# Altium schematic sheet Sheet1.SchDoc: Project Vega - Client Node
size A4; DrawnBy: Jithendra H S; Revision: 1; SheetNumber: 2; SheetTotal: 2
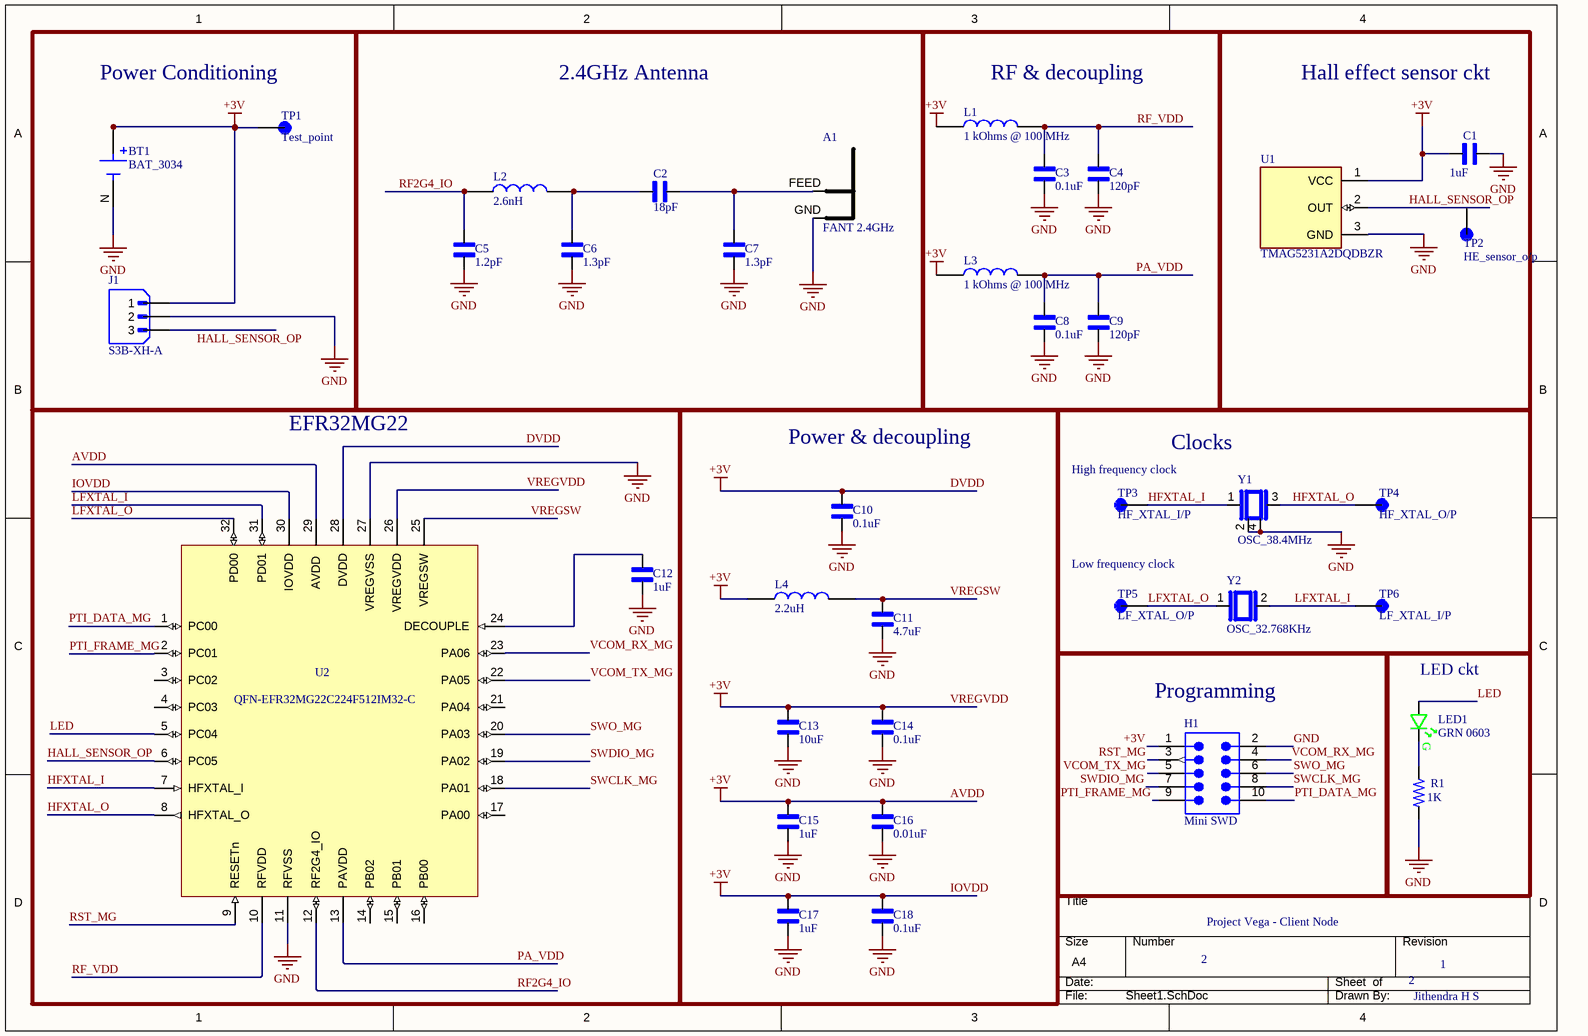
[diagram p0: Sheet1.SchDoc]

## Parts
A1  FANT 2.4GHz  [FANT_2P4]
BT1  BAT_3034  [BAT_3034]
C1  1uF  [CAPC1608X90]
C2  18pF  [CAPC1608X90]
C3  0.1uF  [CAPC1608X90]
C4  120pF  [CAPC1608X90]
C5  1.2pF  [CAPC1608X90]
C6  1.3pF  [CAPC1608X90]
C7  1.3pF  [CAPC1608X90]
C8  0.1uF  [CAPC1608X90]
C9  120pF  [CAPC1608X90]
C10  0.1uF  [CAPC1608X90]
C11  4.7uF  [CAPC1608X90]
C12  1uF  [CAPC1608X90]
C13  10uF  [CAPC1608X90]
C14  0.1uF  [CAPC1608X90]
C15  1uF  [CAPC1608X90]
C16  0.01uF  [CAPC1608X90]
C17  1uF  [CAPC1608X90]
C18  0.1uF  [CAPC1608X90]
H1  Mini SWD  [FTSH-105-01-XXX-DV-K]
J1  S3B-XH-A  [JST_S3B-XH-A]
L1  1 kOhms @ 100 MHz  [INDC1608X95N]
L2  2.6nH  [INDC1608X95N]
L3  1 kOhms @ 100 MHz  [INDC1608X95N]
L4  2.2uH  [INDC1608X95N]
LED1  GRN 0603  [LED_0603_GRN_WL-SMCW]
R1  1K  [RES_0603]
TP1  Test_point  [TP]
TP2  HE_sensor_o/p  [TP]
TP3  HF_XTAL_I/P  [TP]
TP4  HF_XTAL_O/P  [TP]
TP5  LF_XTAL_O/P  [TP]
TP6  LF_XTAL_I/P  [TP]
U1  TMAG5231A2DQDBZR  [SOT95P237X112-3N]
U2  QFN-EFR32MG22C224F512IM32-C  [QFN32-EFR32xG2xIM32-BR]
Y1  OSC_38.4MHz  [OSC_38.4MHz]
Y2  OSC_32.768KHz  [OSC_32.768KHz]

## Blocks framed on the sheet
Power Conditioning: BT1 J1 TP1
2.4GHz Antenna: A1 C2 C5-C7 L2
RF & decoupling: C3 C4 C8 C9 L1 L3
Hall effect sensor ckt: C1 TP2 U1
EFR32MG22: C12 U2
Power & decoupling: C10 C11 C13-C18 L4
Clocks: TP3-TP6 Y1 Y2
Programming: H1
LED ckt: LED1 R1

## Nets
+3V: BT1.P1(POS) BT1.P2(POS) C1.2 C10.1 C13.1 C14.1 C15.1 C16.1 C17.1 C18.1 H1.1 J1.1 L1.1 L3.1 L4.1 TP1.TP U1.1(VCC) U2.26(VREGVDD) U2.28(DVDD) U2.29(AVDD) U2.30(IOVDD)  [also labelled AVDD, DVDD, IOVDD, VREGVDD]
GND: A1.GND BT1.N(NEG) C1.1 C3.2 C4.2 C5.2 C6.2 C7.2 C8.2 C9.2 C10.2 C11.2 C12.2 C13.2 C14.2 C15.2 C16.2 C17.2 C18.2 H1.2 J1.2 R1.2 U1.3(GND) U2.11(RFVSS) U2.27(VREGVSS) Y1.2 Y1.4
HALL_SENSOR_OP: J1.3 TP2.TP U1.2(OUT) U2.6(PC05)
HFXTAL_I: TP3.TP U2.7(HFXTAL_I) Y1.1
HFXTAL_O: TP4.TP U2.8(HFXTAL_O) Y1.3
LED: LED1.A U2.5(PC04)
LFXTAL_I: TP6.TP U2.31(PD01) Y2.2
LFXTAL_O: TP5.TP U2.32(PD00) Y2.1
PA_VDD: C8.1 C9.1 L3.2 U2.13(PAVDD)
PTI_DATA_MG: H1.10 U2.1(PC00)
PTI_FRAME_MG: H1.9 U2.2(PC01)
RF2G4_IO: C5.1 L2.1 U2.12(RF2G4_IO)
RF_VDD: C3.1 C4.1 L1.2 U2.10(RFVDD)
RST_MG: H1.3 U2.9(RESETn)
SWCLK_MG: H1.8 U2.18(PA01)
SWDIO_MG: H1.7 U2.19(PA02)
SWO_MG: H1.6 U2.20(PA03)
VCOM_RX_MG: H1.4 U2.23(PA06)
VCOM_TX_MG: H1.5 U2.22(PA05)
VREGSW: C11.1 L4.2 U2.25(VREGSW)
NetA1_FEED: A1.FEED C2.2 C7.1
NetC2_1: C2.1 C6.1 L2.2
NetC12_1: C12.1 U2.24(DECOUPLE)
NetLED1_C: LED1.C R1.1

Not connected (* = marked no-connect by the designer): U2 3(PC02) 4(PC03) 14(PB02) 15(PB01) 16(PB00) 17(PA00) 21(PA04)

## Notes on the sheet
- (near TP3) High frequency clock
- Low frequency clock
- THIS DOCUMENT AND THE DATA DISCLOSED HEREIN OR
- HEREWITH IS THE PROPERTY OF ALTIUM LIMITED AND MAY
- DWG NO:
- REVISION
- REV:
- DESCRIPTION
- DATE
- APPROVED
- BE FREELY DISTRIBUTED IN WHOLE. NO RIGHTS ARE
- RESERVED OR EXPRESS OR IMPLIED WARANTEE GIVEN.
- ENG:
- APPROVALS
- PROJECT
- DSN:
- CHK:
- REFERENCE DOCUMENTS
- PROJECT REVISION:
- TITLE
- DOCUMENT REVISION:
- DESIGN ITEM:
- BOM:
- FAB DWG:
- PCB DWG:
- ASSY DWG:
- SCALE:
- A3
- SIZE
- CAGE CODE
- FILE NAME
- DWG NO.
- SHEET
- OF
- REV
- (in symbol LED_green) G

## Library data of the parts
A1 = FANT_2P4: Inverted F antenna
BT1 = BAT_3034: SMT Holder for 20mm Cell-Tin Nickel Plate; MP: 3034; MF: Keystone Electronics Corp.; SnapEDA_Link: https://www.snapeda.com/parts/3034/Keystone+Electronics/view-part/?ref=snap; Price: None; Check_prices: https://www.snapeda.com/parts/3034/Keystone+Electronics/view-part/?ref=eda; Availability: Not in stock; Value: *; Package: None; Supplier 1: Digikey; Supplier Part Number 1: 36-3034-ND
C1-C18 = CC0603KRX7R9BB104: 0.1 ÂµF Â±10% 50V Ceramic Capacitor X7R 0603 (1608 Metric); MF: Yageo; SnapEDA_Link: https://www.snapeda.com/parts/CC0603KRX7R9BB104/Yageo/view-part/?ref=snap; Package: 0603 Yageo; Value: *; MP: CC0603KRX7R9BB104; Check_prices: https://www.snapeda.com/parts/CC0603KRX7R9BB104/Yageo/view-part/?ref=eda
  C1 C10 C14 C15 C17 C18: Supplier 1: Digikey; Supplier Part Number 1: 445-12472-1-ND
  C2: Supplier 1: Digikey; Supplier Part Number 1: 490-14486-1-ND
  C3 C8: Supplier 1: Digikey; Supplier Part Number 1: 445-7456-1-ND
  C4 C9: Supplier 1: Digikey; Supplier Part Number 1: 399-C0603C121J5GAC7867CT-ND
  C5: Supplier 1: Future Electronics; Supplier Part Number 1: 7045208
  C6 C7: Supplier 1: Digikey; Supplier Part Number 1: 490-6120-1-ND
  C11: Supplier 1: Digikey; Supplier Part Number 1: 399-C0603C475K9PAC7867CT-ND
  C12: Supplier 1: Digikey; Supplier Part Number 1: 399-C0603C105M8PAC7867CT-ND
  C13: Supplier 1: Digikey; Supplier Part Number 1: 490-7202-1-ND
  C16: Supplier 1: Digikey; Supplier Part Number 1: 311-4054-1-ND
H1 = Debug Connector Mini SWD - 0.05": Mini SWD 0.05" Pitch Connector - 10 Pin SMT Box Header; Manufacturer: Adafruit Industries; Manufacturer Part Number: 4048; RoHS: No; Category: Connectors; Stock 1: 201; Pricing 1: 1=1.95000 (USD); ComponentLink1URL: https://media.digikey.com/pdf/Data%20Sheets/Adafruit%20PDFs/4048_Web.pdf?src-supplier=Digi-Key; ComponentLink1Description: https://media.digikey.com/pdf/Data%20Sheets/Adafruit%20PDFs/4048_Web.pdf?src-supplier=Digi-Key; Supplier 1: Digikey; Supplier Part Number 1: 1528-2827-ND
J1 = S3B-XH-A: Connector Header Through Hole 3 position 0.098 (2.50mm); MF: JST Sales; MP: B3B-XH-A(LF)(SN); SnapEDA_Link: https://www.snapeda.com/parts/B3B-XH-A(LF)(SN)/JST+Sales+America+Inc./view-part/?ref=snap; Package: None; Value: *; Check_prices: https://www.snapeda.com/parts/B3B-XH-A(LF)(SN)/JST+Sales+America+Inc./view-part/?ref=eda; Supplier 1: Digikey; Supplier Part Number 1: 455-S3B-XH-A-ND
L1-L4 = LQM18DN100M70L: Inductor with Inductance 10uH Tol.+/-20% Package 0603 (1608); MF: Murata Electronics; MP: LQM18DN100M70L; Price: None; SnapEDA_Link: https://www.snapeda.com/parts/LQM18DN100M70L/Murata/view-part/4834755/?ref=snap; Package: 0603 Murata; Availability: Unavailable; Value: *; Supplier 1: Digikey
  L1: Supplier Part Number 1: 240-MI0603J102R-10CT-ND; Supplier 2: Digikey; Supplier Part Number 2: 490-1015-1-ND
  L2: Supplier Part Number 1: 490-13907-1-ND
  L3: Supplier Part Number 1: 490-1015-1-ND
  L4: Supplier Part Number 1: 732-14076-1-ND
LED1 = LED_green: LED, 0603, GREEN, 430MCD, 520NM; Manufacturer: Wurth Electronics; Manufacturer Part Number: 150060GS75000; Dynamic Catalog: 0603 Rectangle with Flat Top Chip LEDs; 3D Model: SMCW_0603.igs / SMCW_0603.stp / SMCW_0603.wrl; Wavelength - Peak: 515nm; Voltage - Forward (Vf) (Typ): 3.2V; Current - Test: 20mA; Viewing Angle: 140°; Lens Type: Clear; Lens Style/Size: Rectangle with Flat Top, 1.1mm x 0.7mm; Other Names: 732-4971-2; Supplier 1: Digi-Key; Stock 1: 34964; Pricing 1: 1=0.14, 50=0.129, 100=0.11, 500=0.095 (USD); Standard Package: 4,000; Category: Optoelectronics; Family: LED Indication - Discrete; Series: WL-SMCW; Packaging: Tape & Reel (TR); Color: Green; Wavelength - Dominant: 520nm; Millicandela Rating: 430mcd; Package / Case: 0603 (1608 Metric); Size / Dimension: 1.60mm L x 0.80mm W; Height: 0.70mm; Mounting Type: Surface Mount; Online Catalog: 0603 Rectangle with Flat Top Chip LEDs; ComponentLink1URL: https://katalog.we-online.de/led/datasheet/150060GS75000.pdf?src-supplier=Digi-Key; ComponentLink1Description: https://katalog.we-online.de/led/datasheet/150060GS75000.pdf?src-supplier=Digi-Key; ComponentLink2URL: http://www.produktinfo.conrad.com/datenblaetter/750000-774999/759427-da-01-en-CHIPLED_0603_W_KL_GRUEN_150060GS75000.pdf?src-supplier=Conrad; ComponentLink2Description: http://www.produktinfo.conrad.com/datenblaetter/750000-774999/759427-da-01-en-CHIPLED_0603_W_KL_GRUEN_150060GS75000.pdf?src-supplier=Conrad; Supplier Part Number 1: 732-4971-1-ND
R1 = RES_0603: Thick film general purpose resistor 0603; MP: RC0603JR-070RL; Availability: Unavailable; Package: None; Value: *; Price: None; Supplier 1: Digikey; Supplier Part Number 1: A106049CT-ND
TP1-TP6 = Test_point: SMT Test Point- Mininature-1000 pc Reels; MP: 5019; MF: Keystone Electronics; Value: *; Availability: In Stock; Purchase-URL: https://pricing.snapeda.com/search/part/5019/?ref=eda; Package: None; Price: None
U1 = TMAG5231A2DQDBZR: SOT-23-3-Digital Switch Omnipolar Switch Push-Pull Hall Effect; MF: {'manufacturer': u'Texas Instruments'}; Package: None; Price: None; Value: *; MP: TMAG5231A2DQDBZR; Availability: Unavailable; Supplier 1: Digikey; Supplier Part Number 1: 296-TMAG5231A2DQDBZRCT-ND
U2 = EFR32MG22C224F512IM32-C: IC RF TxRx + MCU WiFi Bluetooth v5.2, Zigbee® 2.4GHz 32-VFQFN Exposed Pad; Supplier 1: Digikey; Supplier Part Number 1: 336-EFR32MG22C224F512IM32-C-ND
Y1 = OSC_38.4MHz: 38.4 MHz ±10ppm Crystal 10pF 40 Ohms 4-SMD, No Lead; MF: {'manufacturer': u'Murata Electronics'}; MP: XRCGB38M400F2P00R0; Package: None; Price: None; Value: *; Availability: Unavailable; Supplier 1: Digikey; Supplier Part Number 1: 4606-TZ3398BCT-ND
Y2 = OSC_32.768KHz: Tuning Fork Crystal 32.768kHz in 1.2 x 2.0mm package; MF: Micro Crystal; MP: CM8V-T1A-32.768KHZ-7PF-20PPM-TA-QC; Package: SMD-2 Micro Crystal; Price: None; Value: *; SnapEDA_Link: https://www.snapeda.com/parts/CM8V-T1A-32.768KHZ-7PF-20PPM-TA-QC/Micro+Crystal/view-part/?ref=snap; Availability: Not in stock; Check_prices: https://www.snapeda.com/parts/CM8V-T1A-32.768KHZ-7PF-20PPM-TA-QC/Micro+Crystal/view-part/?ref=eda; Supplier 1: Digikey; Supplier Part Number 1: 2195-CM8V-T1A-32.768KHZ-7PF-20PPM-TA-QCCT-ND